# EAGLE schematic wiring (EAGLE 8.5.1)
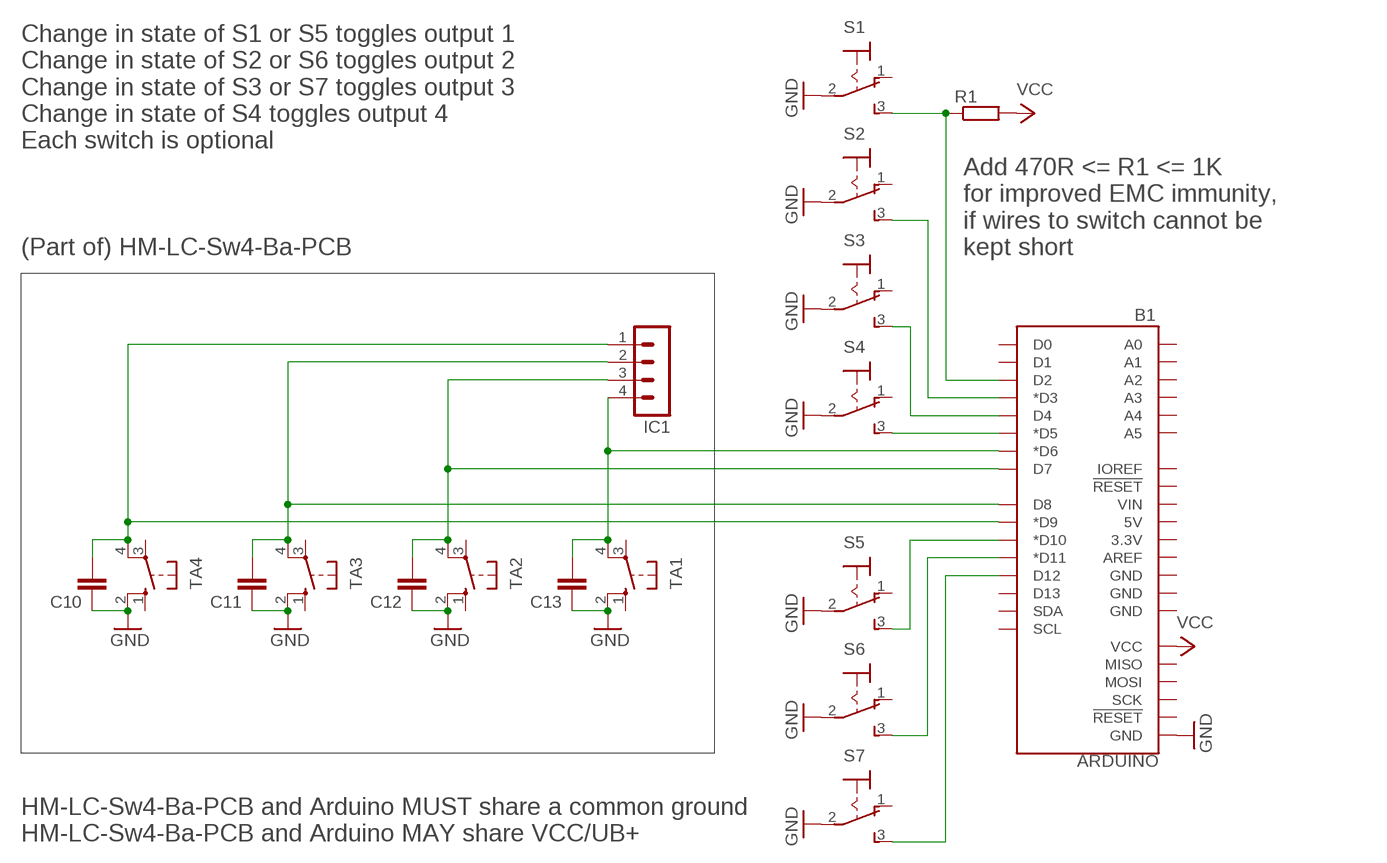
[diagram p0: schematic, sheet 1]

## Parts
B1  ARDUINO  ARDUINO_UNO_R3  [ARDUINO_R3]
C10  C2,5-3  [C2.5-3]
C11  C2,5-3  [C2.5-3]
C12  C2,5-3  [C2.5-3]
C13  C2,5-3  [C2.5-3]
IC1  MA04-1  [MA04-1]
R1  R-EU_0204/5  [0204/5]
S1  320-916  [320-916]
S2  320-916  [320-916]
S3  320-916  [320-916]
S4  320-916  [320-916]
S5  320-916  [320-916]
S6  320-916  [320-916]
S7  320-916  [320-916]
TA1  10-XX  [B3F-10XX]
TA2  10-XX  [B3F-10XX]
TA3  10-XX  [B3F-10XX]
TA4  10-XX  [B3F-10XX]

## Nets
GND: B1.GND@1(GND) C10.1 C11.1 C12.1 C13.1 S1.2(P) S2.2(P) S3.2(P) S4.2(P) S5.2(P) S6.2(P) S7.2(P) TA1.2(S1) TA2.2(S1) TA3.2(S1) TA4.2(S1)
N$1: B1.D6(*D6) C13.2 IC1.4 TA1.4(P1)
N$2: B1.D7 C12.2 IC1.3 TA2.4(P1)
N$3: B1.D8 C11.2 IC1.2 TA3.4(P1)
N$4: B1.D9(*D9) C10.2 IC1.1 TA4.4(P1)
N$5: B1.D5(*D5) S4.3(S)
N$6: B1.D4 S3.3(S)
N$7: B1.D3(*D3) S2.3(S)
N$8: B1.D2 R1.1 S1.3(S)
N$9: B1.D10(*D10) S5.3(S)
N$10: B1.D11(*D11) S6.3(S)
N$11: B1.D12 S7.3(S)
VCC: B1.VCC R1.2
Unconnected: B1.3.3V B1.5V B1.A0 B1.A1 B1.A2 B1.A3 B1.A4 B1.A5 B1.AREF B1.D0 B1.D1 B1.D13 B1.GND@2(GND) B1.GND@3(GND) B1.GND@4(GND) B1.IOREF B1.MISO B1.MOSI B1.RESET@1(!RESET!) B1.RESET@2(!RESET!) B1.SCK B1.SCL B1.SDA B1.VIN S1.1(O) S2.1(O) S3.1(O) S4.1(O) S5.1(O) S6.1(O) S7.1(O) TA1.1(S) TA1.3(P) TA2.1(S) TA2.3(P) TA3.1(S) TA3.3(P) TA4.1(S) TA4.3(P)

## Notes on the sheet
- Change in state of S1 or S5 toggles output 1
  Change in state of S2 or S6 toggles output 2
  Change in state of S3 or S7 toggles output 3
  Change in state of S4 toggles output 4
  Each switch is optional
- (Part of) HM-LC-Sw4-Ba-PCB
- Add 470R <= R1 <= 1K 
  for improved EMC immunity, 
  if wires to switch cannot be 
  kept short
- HM-LC-Sw4-Ba-PCB and Arduino MUST share a common ground
  HM-LC-Sw4-Ba-PCB and Arduino MAY share VCC/UB+

## Library data of the parts
B1 = SparkFun-Boards:ARDUINO_UNO_R3: Arduino R3 Footprint with SPI header Arduino Uno R3 Compatible Footprint. Matches PCB size of the original board. SparkFun Products: SAMD21 Dev Breakout <https://www.sparkfun.com/products/13672> RedBoard <https://www.sparkfun.com/products/12757> R3 Stackable Headers <https://www.sparkfun.com/products/11417>
C10-C13 = capacitor-wima:C: CAPACITOR naming: grid - package width
IC1 = con-lstb:MA04-1: PIN HEADER; OC_FARNELL: unknown; OC_NEWARK: unknown
R1 = resistor:R-EU_: RESISTOR, European symbol
S1-S7 = switch:320-916: TOGGLE SWITCH distributor RS Components
TA1-TA4 = switch-omron:10-XX: OMRON SWITCH; MPN: B3F-1000; OC_FARNELL: 176432; OC_NEWARK: 36M3542